# EAGLE design LPmini-Prototype_1.2 (EAGLE 6.4)
COMPANY: ADAFRUIT INDUSTRIES; DRAWN: KTOWN; REV: B
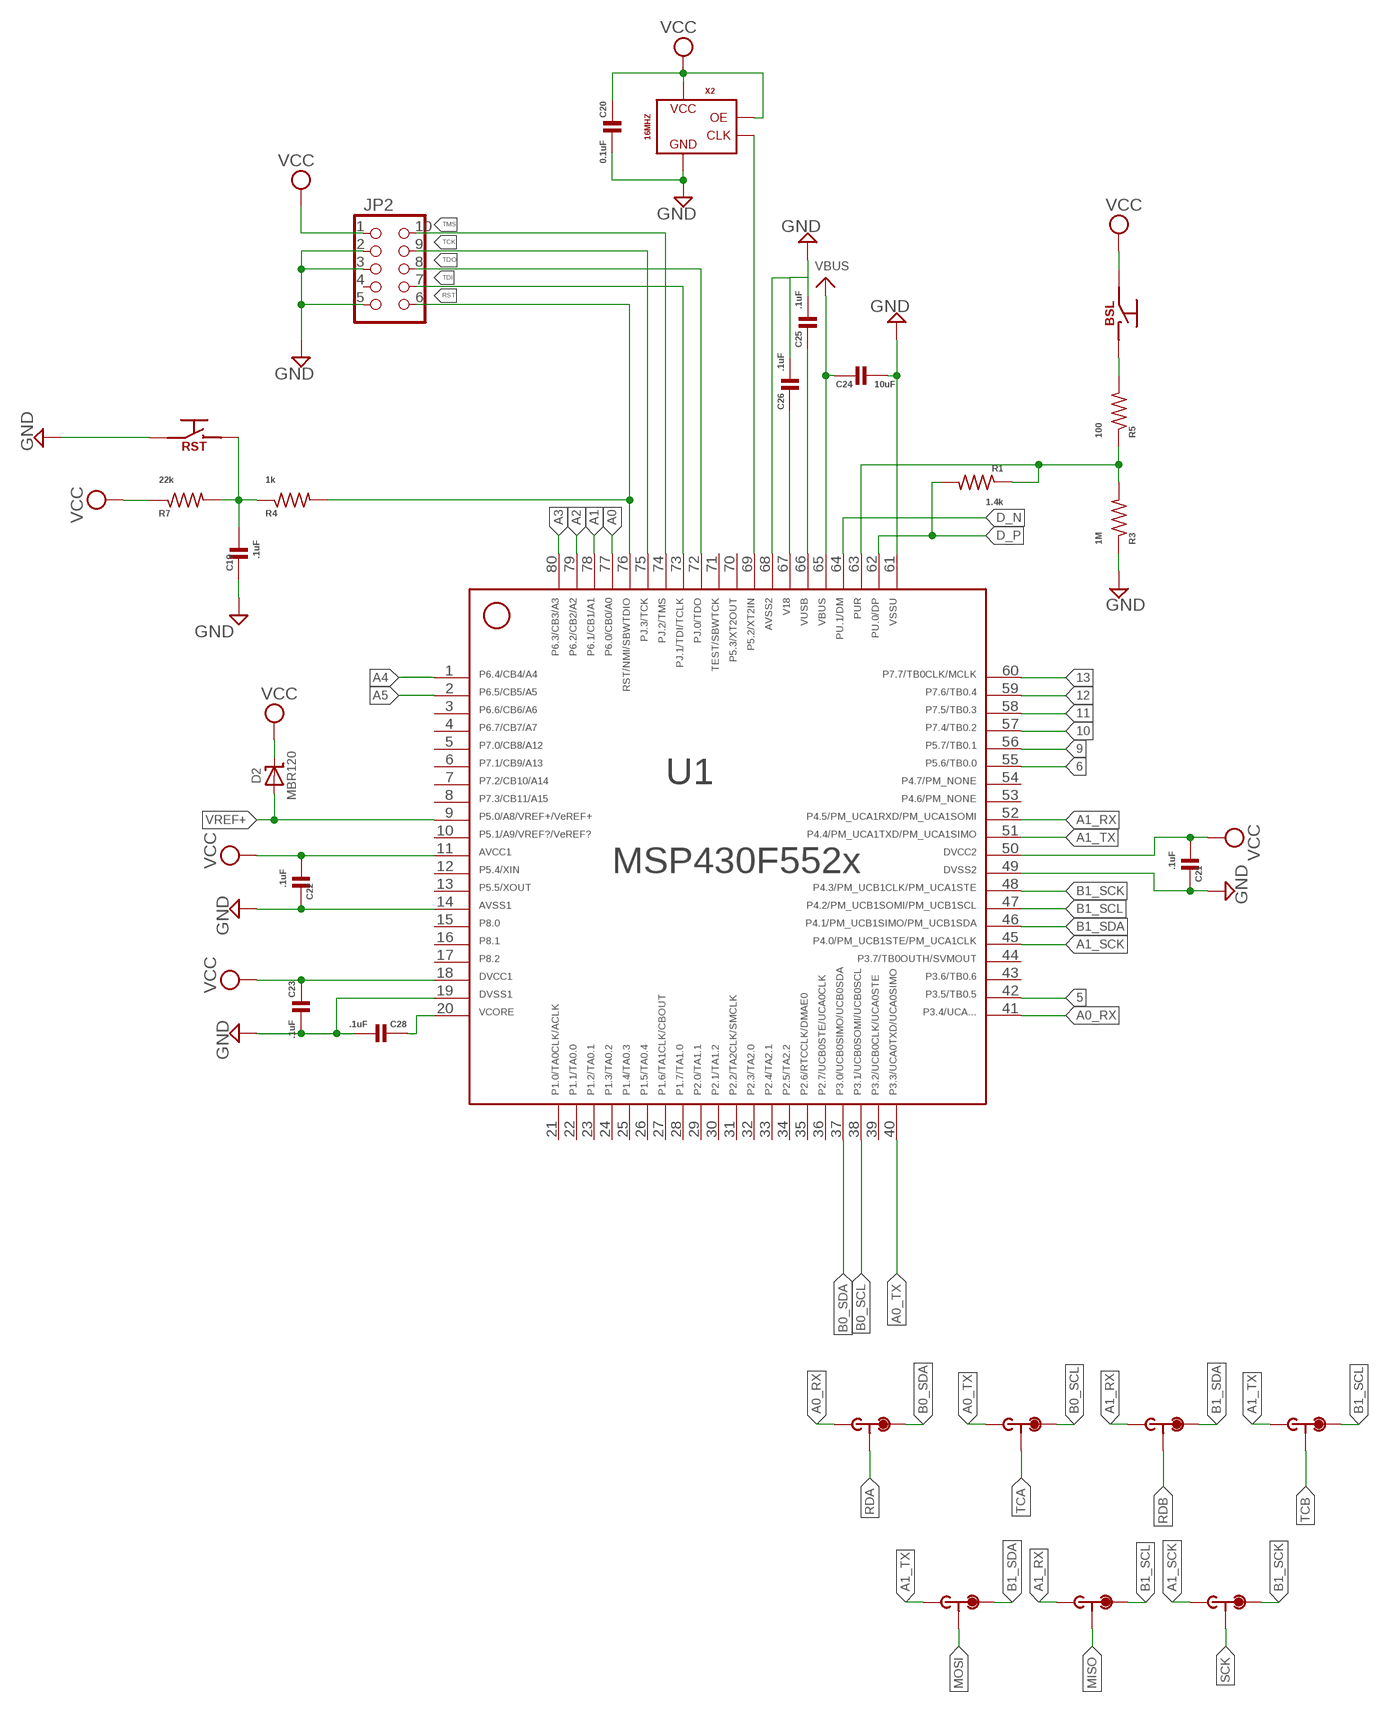
[diagram p0: schematic, sheet 1, part 1 of 2]
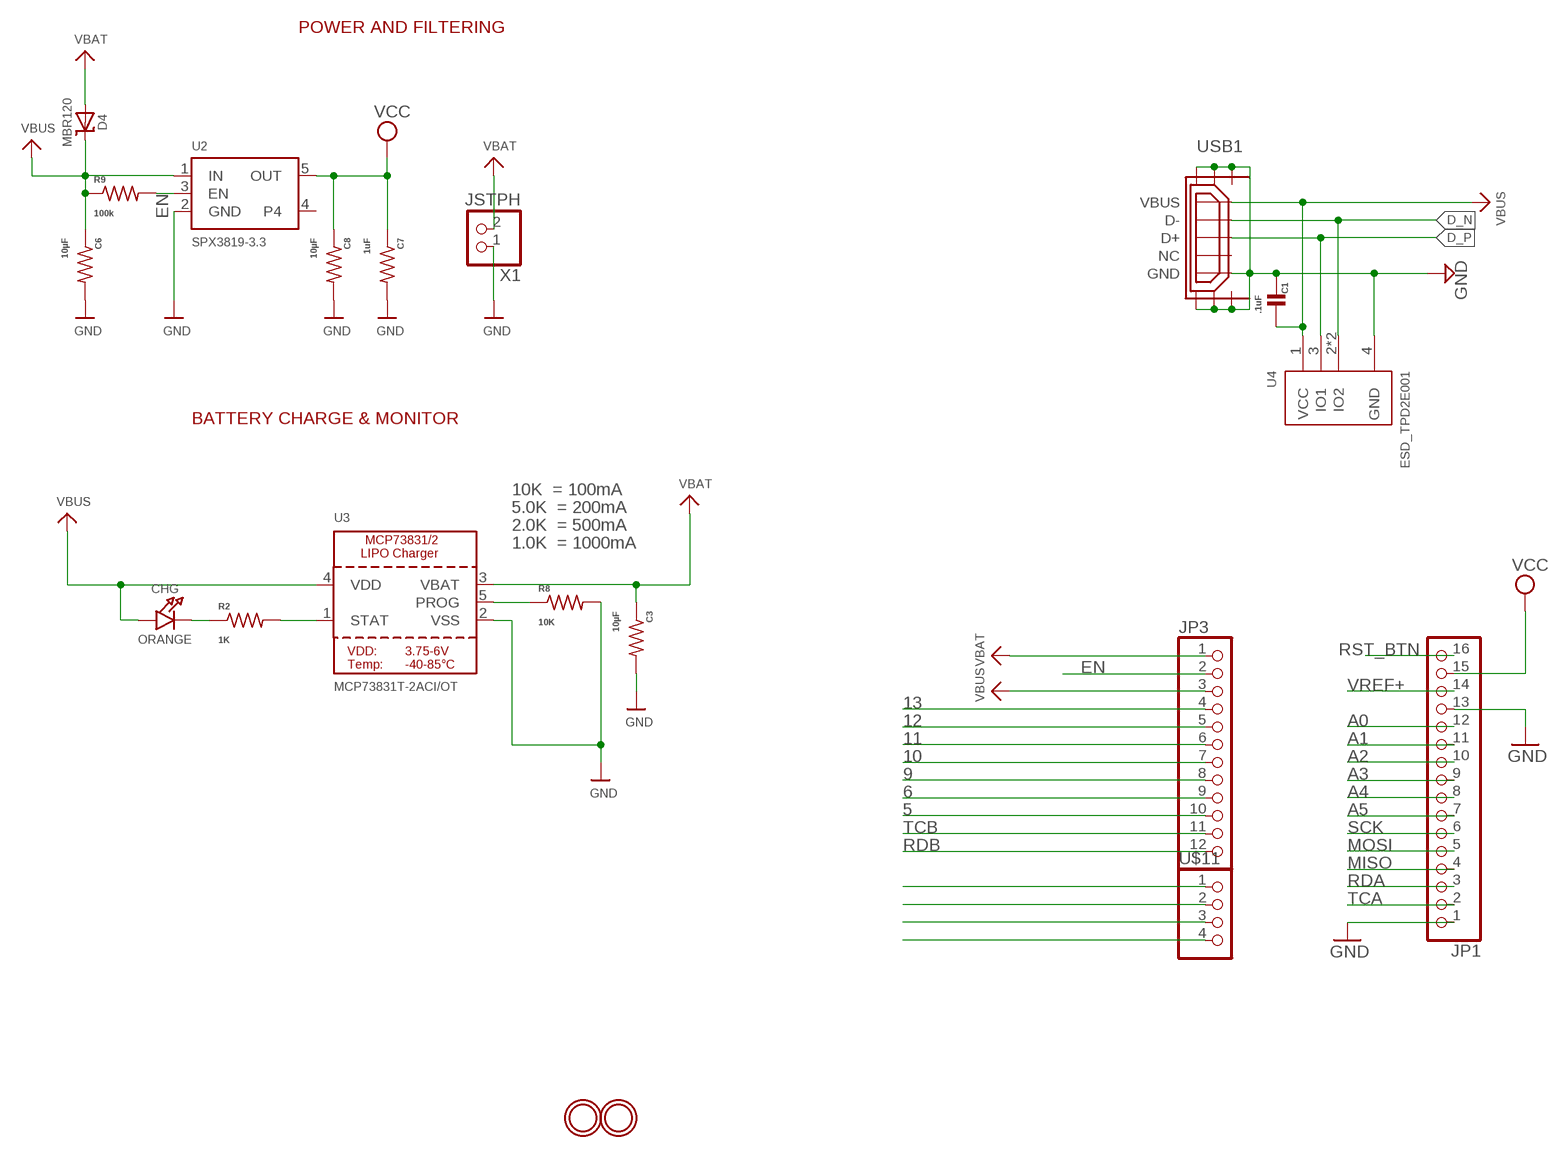
[diagram p1: schematic, sheet 1, part 2 of 2]

## Parts
BSL  PB_SMALL_SMD  [PB_KMR2]
C1  .1uF  C-EUC0402  [C0402]
C3  10µF  R-US_R0603  [R0603]
C6  10µF  R-US_R0603  [R0603]
C7  1uF  R-US_R0402  [R0402]
C8  10µF  R-US_R0603  [R0603]
C19  .1uF  C-EUC0402  [C0402]
C20  0.1uF  C-EUC0402  [C0402]
C21  .1uF  C-EUC0402  [C0402]
C22  .1uF  C-EUC0402  [C0402]
C23  .1uF  C-EUC0402  [C0402]
C24  10uF  C-EUC0603  [C0603]
C25  .1uF  C-EUC0402  [C0402]
C26  .1uF  C-EUC0402  [C0402]
C28  .1uF  C-EUC0402  [C0402]
CHG  ORANGE  LED0805_NOOUTLINE  [CHIPLED_0805_NOOUTLINE]
D2  MBR120  DIODE-SCHOTTKYSOD-123  [SOD-123]
D4  MBR120  DIODE-SCHOTTKYSOD-123  [SOD-123]
JP1  HEADER-1X16ROUND  [1X16_ROUND]
JP2  PINHD_2X05SMD  [2X05-SMALL_SMD]
JP3  HEADER-1X12  [1X12_ROUND]
R1  1.4k  R-US_R0402  [R0402]
R2  1K  R-US_R0402  [R0402]
R3  1M  R-US_R0402  [R0402]
R4  1k  R-US_R0402  [R0402]
R5  100  R-US_R0402  [R0402]
R7  22k  R-US_R0402  [R0402]
R8  10K  R-US_R0402  [R0402]
R9  100k  R-US_R0402  [R0402]
RST  PB_SMALL_SMD  [PB_KMR2]
U1  TI_MSP430_V16_INTERN_F552X---PN80  [TI_MSP430_V16_INTERN_PN80]
U2  SPX3819-3.3  VREG_SOT23-5  [SOT23-5]
U3  MCP73831T-2ACI/OT  MCP73831/2  [SOT23-5]
U4  ESD_TPD2E001  [PROJECT7264_TPD2E001-DRL]
U$2  3PT_SOLDER_JUMPER  [SOLDER_JUMPER_3]
U$4  3PT_SOLDER_JUMPER  [SOLDER_JUMPER_3]
U$5  3PT_SOLDER_JUMPER  [SOLDER_JUMPER_3]
U$6  3PT_SOLDER_JUMPER  [SOLDER_JUMPER_3]
U$8  3PT_SOLDER_JUMPER  [SOLDER_JUMPER_3]
U$9  3PT_SOLDER_JUMPER  [SOLDER_JUMPER_3]
U$10  3PT_SOLDER_JUMPER  [SOLDER_JUMPER_3]
U$11  PINHD_1X4  [1X04]
U$31  MOUNTINGHOLE2.5  [MOUNTINGHOLE_2.5_PLATED]
U$32  MOUNTINGHOLE2.5  [MOUNTINGHOLE_2.5_PLATED]
USB1  USB_CON-UPDATE_USB_MICRO_FLIPPED  [USB_CON-UPDATE_HIROSE-ZX62R-B-5P]
X1  JSTPH  CON_JST_PH_2PIN  [JSTPH2]
X2  16MHZ  OSCILLATOR_SMDHC335R  [OSCILLATOR_3.3X2.6]

## Nets
5: JP3.10 U1.42
6: JP3.9 U1.55
9: JP3.8 U1.56
10: JP3.7 U1.57
11: JP3.6 U1.58
12: JP3.5 U1.59
13: JP3.4 U1.60
A0: JP1.12 U1.77
A0_RX: U1.41 U$2.2(NO)
A0_TX: U1.40 U$8.2(NO)
A1: JP1.11 U1.78
A1_RX: U1.52 U$5.2(NO) U$9.2(NO)
A1_SCK: U1.45 U$6.2(NO)
A1_TX: U1.51 U$4.2(NO) U$10.2(NO)
A2: JP1.10 U1.79
A3: JP1.9 U1.80
A4: JP1.8 U1.1
A5: JP1.7 U1.2
B0_SCL: U1.38 U$8.1(NC)
B0_SDA: U1.37 U$2.1(NC)
B1_SCK: U1.48 U$6.1(NC)
B1_SCL: U1.47 U$5.1(NC) U$10.1(NC)
B1_SDA: U1.46 U$4.1(NC) U$9.1(NC)
D_N: U1.64 U4.2(IO2) U4.5(IO2) USB1.D-
D_P: R1.2 U1.62 U4.3(IO1) USB1.D+
EN: JP3.2 R9.2 U2.3(EN)
GND: C1.2 C3.2 C6.2 C7.2 C8.2 C19.2 C20.2 C21.2 C22.2 C23.2 C24.2 C25.2 C26.2 C28.2 JP1.1 JP1.13 JP2.2 JP2.3 JP2.5 R3.1 R8.2 RST.1A(A) RST.1B(A) U1.14 U1.19 U1.49 U1.61 U1.68 U2.2(GND) U3.2(VSS) U4.4(GND) USB1.GND USB1.SHIELD1 USB1.SHIELD2 USB1.SHIELD3 USB1.SHIELD4 USB1.SHIELD5 USB1.SHIELD6 X1.1 X2.2
MISO: JP1.4 U$5.C(IN)
MOSI: JP1.5 U$4.C(IN)
N$1: CHG.C R2.1
N$2: U$11.1
N$3: R2.2 U3.1(STAT)
N$4: R8.1 U3.5(PROG)
N$5: BSL.2A(B) BSL.2B(B) R5.2
N$6: R1.1 R3.2 R5.1 U1.63
N$7: U$11.2
N$8: U$11.3
N$9: U$11.4
N$23: C25.1 U1.66
N$24: C26.1 U1.67
N$25: C28.1 U1.20
N$40: U1.69 X2.3
RDA: JP1.3 U$2.C(IN)
RDB: JP3.12 U$9.C(IN)
RST: JP2.6 R4.2 U1.76
RST_BTN: C19.1 JP1.16 R4.1 R7.2 RST.2A(B) RST.2B(B)
SCK: JP1.6 U$6.C(IN)
TCA: JP1.2 U$8.C(IN)
TCB: JP3.11 U$10.C(IN)
TCK: JP2.9 U1.75
TDI: JP2.7 U1.73
TDO: JP2.8 U1.72
TMS: JP2.10 U1.74
VBAT: C3.1 D4.A JP3.1 U3.3(VBAT) X1.2
VBUS: C1.1 C6.1 C24.1 CHG.A D4.C JP3.3 R9.1 U1.65 U2.1(IN) U3.4(VDD) U4.1(VCC) USB1.VBUS
VCC: BSL.1A(A) BSL.1B(A) C7.1 C8.1 C20.1 C21.1 C22.1 C23.1 D2.C JP1.15 JP2.1 R7.1 U1.11 U1.18 U1.50 U2.5(OUT) X2.1 X2.4
VREF+: D2.A JP1.14 U1.9
Unconnected: JP2.4 U1.3 U1.4 U1.5 U1.6 U1.7 U1.8 U1.10 U1.12 U1.13 U1.15 U1.16 U1.17 U1.21 U1.22 U1.23 U1.24 U1.25 U1.26 U1.27 U1.28 U1.29 U1.30 U1.31 U1.32 U1.33 U1.34 U1.35 U1.36 U1.39 U1.43 U1.44 U1.53 U1.54 U1.70 U1.71 U2.4 USB1.NC

## Notes on the sheet
- POWER AND FILTERING
- BATTERY CHARGE & MONITOR
- 10K  = 100mA
- 5.0K  = 200mA
- 2.0K  = 500mA
- 1.0K  = 1000mA

## Library data of the parts
BSL RST = 0Joseph:PB_SMALL_SMD
C1 C19-C26 C28 = rcl:C-EU: CAPACITOR, European symbol
C3 C6-C8 R1-R5 R7-R9 = rcl:R-US_: RESISTOR, American symbol
CHG = microbuilder:LED: LED 0603 - 0603 Surface Mount Package 2mA: Green LED - Low Power (3.9mcd, 2ma, 1.7Vf) - Digikey: 475-2709-2-ND Orange LED - Low Power (9.8mcd, 2ma, 1.8Vf) - Digikey: 475-1194-2-ND Red LED - Low Power (5mcd, 2ma, 1.8Vf) - Digikey: 475-1195-2-ND Yellow LED - Low Power (7mcd, 2ma, 1.8Vf) - Digikey: 475-1196-2-ND 5mA: Blue LED - Low Power (17mcd, 5ma, 2.9Vf) - Digikey: LNJ937W8CRACT-ND 0805 - 0805 Surface Mount Package 2mA: Red LED (8.8mcd, 2mA, 1.8Vf, Clear) - Low Power [Digikey: 475-2510-1-ND] Green LED (5mcd, 2mA, 1.8Vf, Clear) - Low Power [Digikey: 475-2730-1-ND] Yellow LED (11.3mcd, 2mA, 1.8Vf, Clear) - Low Power [Digikey: 475-2555-1-ND] 20mA: Red LED (104mcd, 20mA, Diffused) - LS R976 [Digikey: 475-1278-6-ND] Red LED (12mcd, 20mA, 2.0Vf, Clear) - APT2012EC [Digikey: 754-1128-1-ND] Green LED (15mcd, 20mA, 2.2Vf, Clear) - APT2012GC [Digikey: 754-1131-1-ND] Orange LED (160mcd, 20mA, 2.1Vf, Clear) - APT2012SECK [Digikey: 754-1130-1-ND] 1206 - 1206 Surface Mount Package Green LED (26mcd, 20mA, Diffused) - LG N971 [Digikey: 475-1407-6-ND] Red LED (15mcd, 20mA, Diffused) - LH N974 [Digikey: 475-1416-6-ND] Cree - Cree High-Power Surface Mount LEDs XPEBWT-L1-0000-00D50 - White 111lm 350mA 2.9Vf 6200K 110° XTEAWT-00-0000-00000LEE3 - White 114lm 350mA 2.85Vf 5000K 115° Everlight - Everlight 45-21 Series Surface Mount LEDs 45-21/QK2C-B2832AC2CB2/2T - Warm White 2000mcd 20mA 3.25Vf 3050K 120° 45-21/LK2C-B38452C4CB2/2T - Nuetral White 2000mcd 20mA 3.25Vf 4150K 120° 45-21/LK2C-B50634C6CB2/2T - Cold White 2200mcd 20mA 3.25Vf 5650K 120° PLCC2 Reverse Mount LS T77K-J1L2-1-0-2-R18-Z - Red 11.25mcd 2mA 1.8Vf 630nm 120° LO T77K-L1M2-24-Z - Orange 19.6mcd 2mA 1.8Vf 606nm 120° LY T77K-K2M1-26-Z - Yellow 15.7mcd 2mA 1.8Vf 587nm 120°
D2 D4 = microbuilder:DIODE-SCHOTTKY
JP1 = microbuilder:HEADER-1X16: PIN HEADER
JP2 = 0Joseph:PINHD_2X05
JP3 = microbuilder:HEADER-1X12
U1 = 0Joseph:TI_MSP430_V16_INTERN_F552X---PN80: ***MSP430F552X***PN80 http://www.ti.com/lit/gpn/msp430f5529 Rev1.0 06/2010 For F552X where X is 1,5,7,9
U2 = microbuilder:VREG_SOT23-5: SOT23-5 Fixed Voltage Regulators Part Current Out V Out V In V Dropout θJA (°C/W) TJ (°C) Digikey Part No. ADP121 150mA 3.3V 3.4-5.5V 0.09V @ 150mA -- -- ADP121-AUJZ33R7CT-ND ADP121 150mA 3.0V 3.1-5.5V 0.09V @ 150mA -- -- ADP121-AUJZ30R7CT-ND ADP122 300mA 3.3V 3.4-5.5V 0.085V @ 300mA -- -- ADP122AUJZ-3.3-R7CT-ND ADP1712 300mA 3.3V 3.5-5.5V 0.17V @ 300mA -- -- ADP1712AUJZ-3.3-R7TR-ND AP7311 (Low Cost) 150mA 3.3V 3.5-6V 0.15V @ 150mA -- -- AP7311-33WG-7DICT-ND LD39015M18R 150mA 1.8V 1.9V-5.5V 0.08V @ 100mA -- -- 497-6977-1-ND LP2985A-33DBVR 150mA 3.3V 3.3-16V 0.28V @ 150mA 206 150 296-18479-1-ND MCP1824T-3302E/OT 300mA 3.3V 3.5V-6V 0.2V @ 300mA -- -- MCP1824T-3302E/OTCT-ND MIC5205-2.5YM5 TR 150mA 2.5V 2.7-16V 0.165V @ 150mA -- -- 576-1257-2-ND MIC5205-3.0YM5 TR 150mA 3.0V 3.2V-16V 0.165V @ 150mA -- -- 576-1258-2-ND MIC5205-3.3YM5 TR 150mA 3.3V 3.5V-16V 0.165V @ 150mA -- -- 576-1259-2-ND TPS780330220 150mA 3.3V+2.2V 3.6-5.5V 250mV Max -- -- 296-23332-1-ND TDA3663/N1,135 100mA 3.3V 3.5-45V 0.18V @ 50mA -- -- 568-5343-1-ND Max operating temp can be calculated using θJA, TJ (max junction temperature), and power in watts. Set the "Maximum Ambient Temperature" until it reaches TJ ("Max Junction Temperature"), which is the absolute limit for safe use of the regulator: Heat Sink Temperature Calculator <http://www.daycounter.com/Calculators/Heat-Sink-Temperature-Calculator.phtml> For example, With 12V source into a 3.3V LP2985 and a 30mA load, we are dissipating (12V-3.3V) * 0.03A = 0.261W. With a θJA of 206 °C/W, a TJ of 150°C, and 261mW we can safely use the chip without a heat sink up to 75°C (=147.1°C Junction Temperature).
U3 = microbuilder:MCP73831/2: MCP73831/2 LIPO Charger VDD: 3.75 - 6V Temp -40 - 85°C Programmable Charge Rate: 15-500mA NOTE: STAT is a tri-state logic output on the MCP73831 and an open-drain output on the MCP73832. SOT23-5 with 4.2V output and tri-state logic on STAT = MCP73831T-2ACI/OT
U4 = 0Joseph:ESD_TPD2E001: TPD2E001 ESD-protection diode array
U$2 U$4-U$6 U$8-U$10 = 0Joseph:3PT_SOLDER_JUMPER
U$11 = 0Joseph:PINHD_1X4
U$31 U$32 = microbuilder:MOUNTINGHOLE: Mounting Hole For #2 screws (0.086"/2.18mm width, 0.094"/2.4mm hole) use 2.5mm; BOM: EXCLUDE
USB1 = 0Joseph:USB_CON-UPDATE_USB_MICRO_FLIPPED
X1 = microbuilder:CON_JST_PH_2PIN: JST 2-Pin Right-Angle Connector PH-Series - 4UConnector: 17311 SH-Series - 4UConnector: 07278
X2 = 0Joseph:OSCILLATOR_SMD

## Board
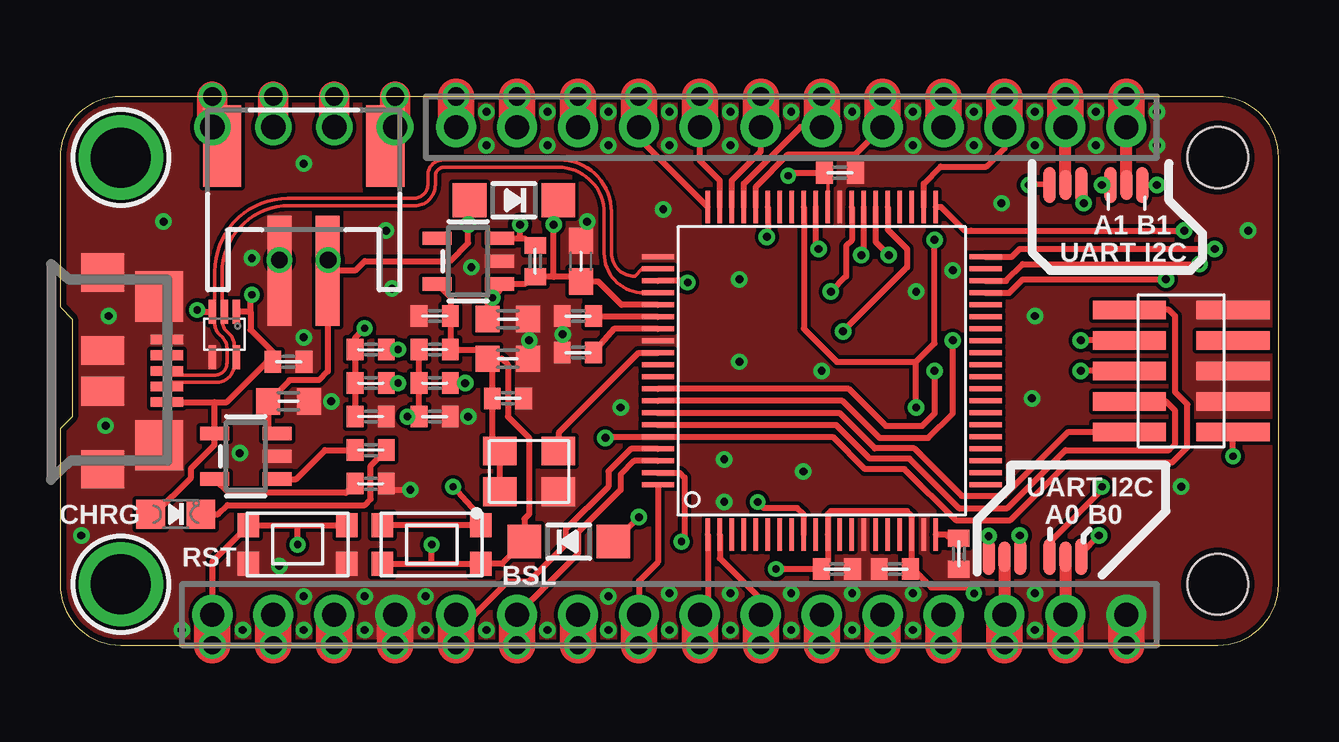
[diagram p2: board, top side]
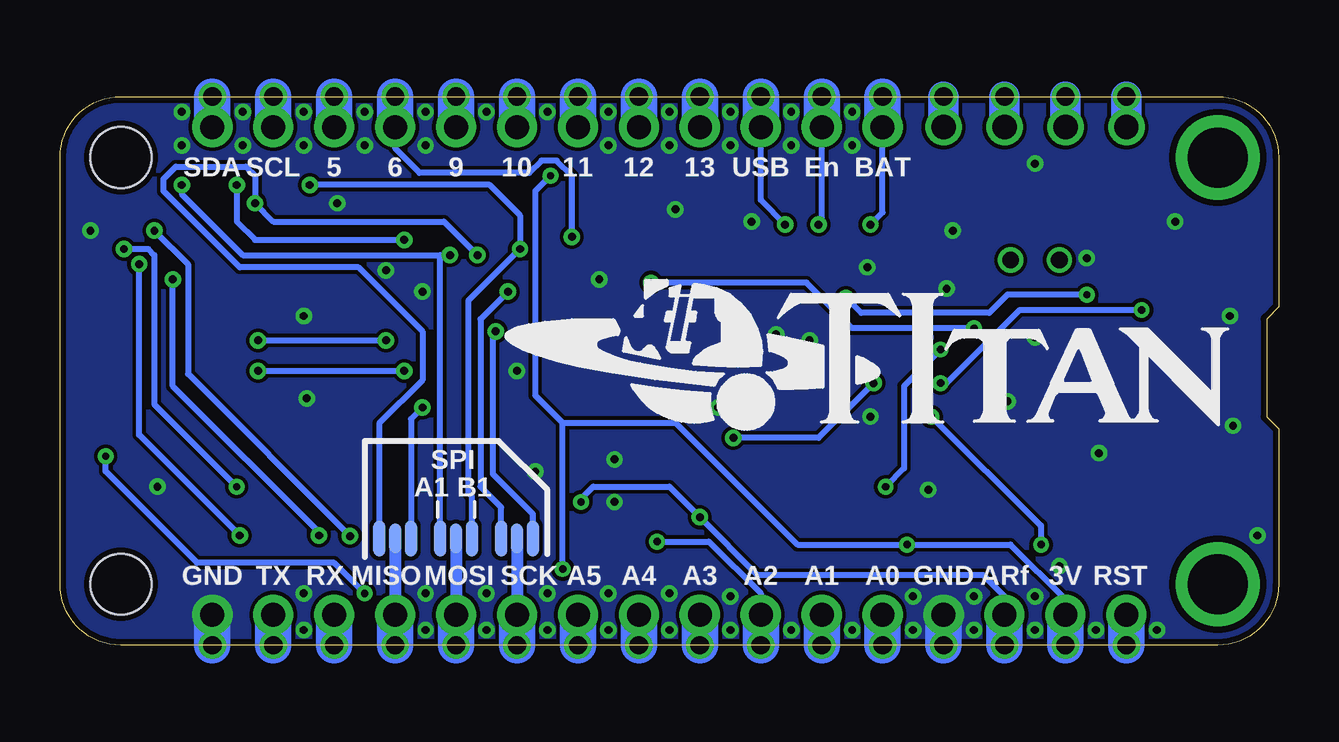
[diagram p3: board, bottom side, seen from below]

Size 50.8 x 22.86 mm. Coordinates in mm from the lower left corner, seen from the top.
Outline: 48.26,0 arc90 50.8,2.54 50.8,20.32 arc90 48.26,22.86 2.54,22.86 arc90 0,20.32 0,14.1 0.51,13.59 0.51,9.53 0,9.02 0,2.54 arc90 2.54,0 48.26,0
Copper layers (1*16): Top 0.0356mm / dielectric 1.5011mm / Bottom 0.0356mm
Design rules "Joseph *": minimum track width 6mil, minimum drill 12mil, track to track 6mil, track to pad 6mil, pad to pad 6mil, via to via 6mil, smd to smd 0mil, copper to edge 10mil, drill to drill 6mil, minimum pad ring 7mil, minimum via ring 7mil, stop-mask expansion 1mil, vias tented up to drill 50mil, thermal gap 6mil
Holes 2.54 mm at 48.26,20.32 48.26,2.54

### Footprints (pad centres in the part's own frame; a part is rotated, then mirrored left to right if it is on the bottom)
PB_KMR2 = smd 0.9 x 1: 1A -2.05,0.8; 1B 2.05,0.8; 2A -2.05,-0.8; 2B 2.05,-0.8
C0402 = smd 0.7 x 0.9: 1 -0.65,0; 2 0.65,0
R0603 = smd 1 x 1.1: 1 -0.85,0; 2 0.85,0
R0402 = smd 0.7 x 0.9: 1 -0.65,0; 2 0.65,0
C0603 = smd 1.1 x 1: 1 -0.85,0; 2 0.85,0
CHIPLED_0805_NOOUTLINE = smd 1.2 x 1.2: A 0,-1.05; C 0,1.05
SOD-123 = smd 1.4 x 1.4: A 1.85,0; C -1.85,0
1X16_ROUND = drill 1 pad 1.676: 1 -19.05,0; 2 -16.51,0; 3 -13.97,0; 4 -11.43,0; 5 -8.89,0; 6 -6.35,0; 7 -3.81,0; 8 -1.27,0; 9 1.27,0; 10 3.81,0; 11 6.35,0; 12 8.89,0; 13 11.43,0; 14 13.97,0; 15 16.51,0; 16 19.05,0
2X05-SMALL_SMD = smd 0.762 x 3.048: 1 -2.54,-2.159; 2 -1.27,-2.159; 3 0,-2.159; 4 1.27,-2.159; 5 2.54,-2.159; 6 2.54,2.159; 7 1.27,2.159; 8 0,2.159; 9 -1.27,2.159; 10 -2.54,2.159
1X12_ROUND = drill 1 pad 1.676: 1 -13.97,0; 2 -11.43,0; 3 -8.89,0; 4 -6.35,0; 5 -3.81,0; 6 -1.27,0; 7 1.27,0; 8 3.81,0; 9 6.35,0; 10 8.89,0; 11 11.43,0; 12 13.97,0
TI_MSP430_V16_INTERN_PN80 = smd 1.35 x 0.2: 1 -6.825,4.75; 2 -6.825,4.25; 3 -6.825,3.75; 4 -6.825,3.25; 5 -6.825,2.75; 6 -6.825,2.25; 7 -6.825,1.75; 8 -6.825,1.25; 9 -6.825,0.75; 10 -6.825,0.25; 11 -6.825,-0.25; 12 -6.825,-0.75; 13 -6.825,-1.25; 14 -6.825,-1.75; 15 -6.825,-2.25; 16 -6.825,-2.75; 17 -6.825,-3.25; 18 -6.825,-3.75; 19 -6.825,-4.25; 20 -6.825,-4.75; 41 6.825,-4.75; 42 6.825,-4.25; 43 6.825,-3.75; 44 6.825,-3.25; 45 6.825,-2.75; 46 6.825,-2.25; 47 6.825,-1.75; 48 6.825,-1.25; 49 6.825,-0.75; 50 6.825,-0.25; 51 6.825,0.25; 52 6.825,0.75; 53 6.825,1.25; 54 6.825,1.75; 55 6.825,2.25; 56 6.825,2.75; 57 6.825,3.25; 58 6.825,3.75; 59 6.825,4.25; 60 6.825,4.75 | smd 0.2 x 1.35: 21 -4.75,-6.825; 22 -4.25,-6.825; 23 -3.75,-6.825; 24 -3.25,-6.825; 25 -2.75,-6.825; 26 -2.25,-6.825; 27 -1.75,-6.825; 28 -1.25,-6.825; 29 -0.75,-6.825; 30 -0.25,-6.825; 31 0.25,-6.825; 32 0.75,-6.825; 33 1.25,-6.825; 34 1.75,-6.825; 35 2.25,-6.825; 36 2.75,-6.825; 37 3.25,-6.825; 38 3.75,-6.825; 39 4.25,-6.825; 40 4.75,-6.825; 61 4.75,6.825; 62 4.25,6.825; 63 3.75,6.825; 64 3.25,6.825; 65 2.75,6.825; 66 2.25,6.825; 67 1.75,6.825; 68 1.25,6.825; 69 0.75,6.825; 70 0.25,6.825; 71 -0.25,6.825; 72 -0.75,6.825; 73 -1.25,6.825; 74 -1.75,6.825; 75 -2.25,6.825; 76 -2.75,6.825; 77 -3.25,6.825; 78 -3.75,6.825; 79 -4.25,6.825; 80 -4.75,6.825
SOT23-5 = smd 0.55 x 1.2: 1 -0.95,-1.3; 2 0,-1.3; 3 0.95,-1.3; 4 0.95,1.3; 5 -0.95,1.3
PROJECT7264_TPD2E001-DRL = smd 0.3 x 1: 1 -0.5,-0.95; 2 0,-0.95; 3 0.5,-0.95; 4 0.5,0.95; 5 -0.5,0.95
SOLDER_JUMPER_3 = smd 0.508 x 1.524: 1 -0.66,0; 2 0.66,0 | smd 0.508 x 1.27: C 0,0
1X04 = drill 1.016: 1 -3.81,0; 2 -1.27,0; 3 1.27,0; 4 3.81,0
MOUNTINGHOLE_2.5_PLATED = drill 2.5 pad 3.2: P$1 0,0
USB_CON-UPDATE_HIROSE-ZX62R-B-5P = smd 1.35 x 0.4: D+ 2.675,0; D- 2.675,-0.65; GND 2.675,1.3; NC 2.675,0.65; VBUS 2.675,-1.3 | smd 1.778 x 1.6: SHIELD1 0,4.1; SHIELD2 0,-4.1 | smd 2 x 2.1: SHIELD3 2.35,3.1; SHIELD4 2.35,-3.1 | smd 1.778 x 1.2: SHIELD5 0,0.85; SHIELD6 0,-0.85
JSTPH2 = smd 1 x 4.6: 1 -1,-3.7; 2 1,-3.7 | smd 1.6 x 3.4: NC1 -3.4,1.5; NC2 3.4,1.5
OSCILLATOR_3.3X2.6 = smd 1.4 x 1.2: 1 -1.22,-0.85; 2 1.22,-0.85; 3 1.22,0.85; 4 -1.22,0.85

### Placement (x,y rotation side)
BSL  15.49,4.19 180 top
C1  9.53,11.81 0 top
C3  9.53,10.16 0 top
C6  18.67,13.59 0 top
C7  15.62,13.72 180 top
C8  18.67,11.94 0 top
C19  15.62,9.53 0 top
C20  18.67,10.29 0 top
C21  32.51,19.68 0 top
C22  32.38,3.17 0 top
C23  34.8,3.17 180 top
C24  21.72,16 90 top
C25  21.59,13.72 180 top
C26  21.59,12.19 180 top
C28  37.47,3.81 270 top
CHG  4.83,5.46 270 top
D2  21.21,4.32 0 top
D4  18.92,18.54 180 top
JP1  25.4,1.27 180 top
JP2  46.74,11.43 90 top
JP3  30.48,21.59 0 top
R1  12.95,10.92 0 top
R2  12.95,8.13 180 top
R3  12.95,9.53 180 top
R4  15.62,10.92 0 top
R5  12.95,12.32 0 top
R7  15.62,12.32 180 top
R8  12.95,6.73 0 top
R9  19.81,16 90 top
RST  9.91,4.19 180 top
U1  31.75,11.43 90 top
U2  17.02,16 90 top
U3  7.75,7.87 90 top
U4  6.86,12.95 180 top
U$2  39.37,3.68 180 top
U$4  34.29,4.45 0 bottom
U$5  36.83,4.45 0 bottom
U$6  31.75,4.45 0 bottom
U$7  [TITAN_LOGO]  15.88,11.56 0 bottom
U$8  41.91,3.68 180 top
U$9  44.45,19.18 180 top
U$10  41.91,19.18 180 top
U$11  10.16,21.59 0 top
U$31  2.54,20.32 270 top
U$32  2.54,2.54 270 top
USB1  1.78,11.43 0 top
X1  10.16,19.3 0 top
X2  19.56,7.24 0 top

### Tracks (layer width: path | path; a pad name or v marks a point on that pad's centre or on a via)
5  (via drill 0.76)
  Top 0.254: U1.42 36,19.24 36.7,19.94 38.61,19.94 39.37,20.7 JP3.10
  Top 1.524: JP3.10 v39.37,22.86
  Bottom 1.524: JP3.10 v39.37,22.86
6  (via drill 0.33, 0.76)
  Top 0.254: U1.55 29.5,17.05 v29.46,17.02
  Top 1.524: JP3.9 v36.83,22.86
  Bottom 0.254: v29.46,17.02 29.46,19.56 30.1,20.19 30.73,20.19 31.24,19.68 35.81,19.68 36.83,20.7 JP3.9
  Bottom 1.524: JP3.9 v36.83,22.86
9  (via drill 0.76)
  Top 0.254: U1.56 29,19.09 30.35,20.45 33.15,20.45 JP3.8
  Top 1.524: JP3.8 v34.29,22.86
  Bottom 1.524: JP3.8 v34.29,22.86
10  (via drill 0.76)
  Top 0.254: U1.57 28.5,19.23 30.86,21.59 JP3.7
  Top 1.524: JP3.7 v31.75,22.86
  Bottom 1.524: JP3.7 v31.75,22.86
11  (via drill 0.76)
  Top 0.254: U1.58 28,19.36 29.21,20.57 JP3.6
  Top 1.524: JP3.6 v29.21,22.86
  Bottom 1.524: JP3.6 v29.21,22.86
12  (via drill 0.76)
  Top 0.254: U1.59 27.5,19.36 26.67,20.19 JP3.5
  Top 1.524: JP3.5 v26.67,22.86
  Bottom 1.524: JP3.5 v26.67,22.86
13  (via drill 0.76)
  Top 0.254: U1.60 24.13,21.12 JP3.4
  Top 1.524: JP3.4 v24.13,22.86
  Bottom 1.524: JP3.4 v24.13,22.86
A0  (via drill 0.76)
  Top 0.254: U1.77 23.8,8.18 22.86,7.24 22.86,6.6 21.08,4.83 21.08,4.19 19.56,2.67 18.67,2.67 17.27,1.27 JP1.12
  Top 1.524: JP1.12 v16.51,0
  Bottom 1.524: JP1.12 v16.51,0
A0_RX  (via drill 0.33)
  Top 0.254: v38.71,4.55 U$2.2 | U1.41 36.74,18.25 37.72,17.27 37.97,17.27 v46.86,17.27
  Bottom 0.254: v38.71,4.55 45.47,11.3 45.47,15.88 v46.86,17.27
A0_TX  (via drill 0.3, 0.33)
  Top 0.254: U1.40 39.67,16.18 40.01,16.51 v48.13,16.51 | U$8.2 41.27,3.71 41.27,4.32 43.43,6.48 v43.43,6.6
  Bottom 0.254: v48.13,16.51 47.12,16.51 46.86,16.26 46.86,10.03 v43.43,6.6
A1  (via drill 0.76)
  Top 0.254: U1.78 23.94,7.68 23.37,7.11 23.37,6.48 21.59,4.7 21.59,3.81 JP1.11
  Top 1.524: JP1.11 v19.05,0
  Bottom 1.524: JP1.11 v19.05,0
A1_RX  (via drill 0.33)
  Top 0.254: 35.69,11.81 32.38,11.81 31,13.2 U1.52 | 35.69,11.81 36.45,12.57 v36.45,16.89 | v35.69,9.91 35.69,11.81 | U$9.2 v43.43,19.18
  Bottom 0.254: 36.2,4.47 U$5.2 36.17,9.42 v35.69,9.91 | v36.45,16.89 42.67,16.89 43.43,17.65 v43.43,19.18
A1_SCK  (via drill 0.33)
  Top 0.254: U1.45 34.5,17.32 35.31,16.51 35.31,15.75 v32.64,13.08
  Bottom 0.254: U$6.2 31.09,5.46 32.77,7.14 32.77,12.95 v32.64,13.08
A1_TX  (via drill 0.33)
  Top 0.254: v31.62,16.51 31.5,16.63 U1.51 | U$10.2 41.25,19.2 v40.39,19.18
  Bottom 0.254: U$4.2 33.63,6.2 33.78,6.35 33.78,14.35 v31.62,16.51 31.62,17.91 32.89,19.18 v40.39,19.18
A2  (via drill 0.3, 0.76)
  Top 0.254: U1.79 25.84,7.18 26.04,6.99 26.04,4.45 v25.91,4.32
  Top 1.524: JP1.10 v21.59,0
  Bottom 0.254: v25.91,4.32 23.75,4.32 21.59,2.16 JP1.10
  Bottom 1.524: JP1.10 v21.59,0
A3  (via drill 0.76)
  Top 0.254: U1.80 24.93,3.46 24.13,2.67 JP1.9
  Top 1.524: JP1.9 v24.13,0
  Bottom 1.524: JP1.9 v24.13,0
A4  (via drill 0.76)
  Top 0.254: U1.1 27,1.6 JP1.8
  Top 1.524: JP1.8 v26.67,0
  Bottom 1.524: JP1.8 v26.67,0
A5  (via drill 0.76)
  Top 0.254: U1.2 27.5,3.62 29.21,1.91 JP1.7
  Top 1.524: JP1.7 v29.21,0
  Bottom 1.524: JP1.7 v29.21,0
B0_SCL  (via drill 0.33)
  Top 0.254: U1.38 39.44,15.18 40.13,15.88 v47.5,15.88 | U$8.1 42.55,3.71 42.55,3.81 v43.31,4.57
  Bottom 0.254: v47.5,15.88 47.5,8.76 v43.31,4.57
B0_SDA  (via drill 0.33)
  Top 0.254: U1.37 39.57,14.68 40.13,15.24 v46.1,15.24 | U$2.1 40.01,3.71 v40.01,4.57
  Bottom 0.254: v46.1,15.24 46.1,10.79 40.01,4.7 v40.01,4.57
B1_SCK  (via drill 0.33)
  Top 0.254: U1.48 33,16.87 32.77,16.64 32.77,15.37 v32.13,14.73
  Bottom 0.254: U$6.1 32.41,5.74 33.27,6.6 33.27,13.59 v32.13,14.73
B1_SCL  (via drill 0.33)
  Top 0.254: v33.4,16.26 33.5,16.41 U1.47 | U$10.1 42.57,18.31 v42.67,18.41
  Bottom 0.254: v33.4,16.26 34.8,17.65 41.91,17.65 v42.67,18.41 42.67,19.56 43.05,19.94 45.97,19.94 46.48,19.43 46.48,18.92 43.31,15.75 38.35,15.75 35.69,13.08 35.69,11.05 37.49,9.25 U$5.1
B1_SDA  (via drill 0.33)
  Top 0.254: v34.54,16.26 34,16.8 U1.46 | U$9.1 v45.72,19.18
  Bottom 0.254: U$4.1 34.95,16.26 v34.54,16.26 43.18,16.26 45.72,18.8 v45.72,19.18
D_N
  Top 0.152: USB1.D- 4.62,10.95 6.5,10.95 arc90 7.26,11.71 7.26,12.12 | 6.76,13.93 6.76,13.53 arc45 6.94,13.09 7.08,12.95 arc-45 7.26,12.5 7.26,12.12 | 6.76,13.93 U4.2 | U4.5 7.28,12.13 7.26,12.12 | U1.64 24.33,14.68 arc-90 22.68,16.33 22.68,18.01 arc90 20.78,19.91 16,19.91 arc90 15.65,19.56 15.65,19.18 arc-90 14.78,18.31 9.55,18.31 arc90 6.76,15.52 6.76,13.93
D_P  (via drill 0.3)
  Top 0.152: USB1.D+ 4.63,11.25 6.45,11.25 arc90 6.96,11.76 6.96,12.37 arc45 6.77,12.82 6.64,12.96 arc-45 6.45,13.41 6.45,13.94 U4.3 6.45,14 6.45,15.57 arc-90 9.5,18.62 14.73,18.62 arc90 15.34,19.23 15.34,19.61 arc-90 15.95,20.22 20.83,20.22 arc-90 22.99,18.06 22.99,16.34 arc90 23.96,15.37 24.27,15.68 U1.62 | R1.2 v14.1,10.92
  Top 0.254: v5.71,13.97 5.78,13.9 U4.3
  Bottom 0.254: v5.71,13.97 10.79,13.97 13.84,10.92 v14.1,10.92
EN  (via drill 0.33, 0.76)
  Top 0.254: U2.3 19.16,16.95 | 19.16,16.95 19.37,16.95 R9.2 | 19.16,16.95 19.18,16.97 v19.18,17.53
  Top 1.524: JP3.2 v19.05,22.86
  Bottom 0.254: v19.18,17.53 19.05,17.65 JP3.2
  Bottom 1.524: JP3.2 v19.05,22.86
GND  (via drill 0.33, 0.76)
  Top 0.254: R8.2 13.86,6.48 v14.61,6.48
  Top 1.524: JP1.13 v13.97,0 | JP1.1 v44.45,0
  Bottom 1.524: JP1.13 v13.97,0 | JP1.1 v44.45,0
  other vias: 20.95,12.95 19.56,12.7 8,16.13 10.16,20.07 10.16,12.83 33.02,0.64 40.51,10.29 40.64,13.72 37.21,15.62 49.53,17.27 27.69,5.97 23.37,9.91 28.32,11.81 28.32,15.24 25.15,18.16 4.32,17.65 11.3,10.16 17.02,9.53 7.49,8 0.89,4.57 9.14,3.3 17.14,15.75 13.84,14.86 40.64,20.83 46.74,6.6 2.03,13.72 1.91,9.14 39.24,18.41 35.69,14.73 30.48,0.64 35.56,0.64 31.75,11.43 30.99,7.24 27.94,0.64 25.4,0.64 22.86,0.64 20.32,0.64 17.78,0.64 15.24,0.64 12.7,0.64 10.16,0.64 7.62,0.64 5.08,0.64 40.64,0.64 22.86,22.23 17.78,22.23 20.32,22.23 25.4,22.23 27.94,22.23 30.48,22.23 33.02,22.23 35.56,22.23 38.1,22.23 40.64,22.23 43.18,22.23 45.72,22.23 27.69,7.75 40.64,2.16 35.56,2.16 33.02,2.16 30.48,2.16 27.94,2.16 25.4,2.16 22.86,2.03 15.24,2.03 12.7,2.03 10.16,2.03 43.18,20.83 45.72,20.83 38.1,20.83 35.56,20.83 27.94,20.83 25.4,20.83 22.86,20.83 20.32,20.83 17.78,20.83 13.59,17.27 21.97,17.65
  pour Top (no thermals): 0,22.86 0,0 50.8,0 50.8,22.86
  pour Bottom (no thermals): 0,0 50.8,0 50.8,22.86 0,22.86
MISO  (via drill 0.76)
  Top 1.524: JP1.4 v36.83,0
  Bottom 0.508: U$5.C JP1.4
  Bottom 1.524: JP1.4 v36.83,0
MOSI  (via drill 0.76)
  Top 1.524: JP1.5 v34.29,0
  Bottom 0.508: U$4.C JP1.5
  Bottom 1.524: JP1.5 v34.29,0
N$1
  Top 0.254: CHG.C 6.6,5.46 6.99,5.84 12.7,5.84 12.95,6.1 12.95,7.48 R2.1
N$2  (via drill 0.76)
  Top 1.27: U$11.1 v6.35,22.86
  Bottom 1.27: U$11.1 v6.35,22.86
N$3
  Top 0.254: U3.1 9.85,6.92 11.05,8.13 R2.2
N$4
  Top 0.254: R8.1 11.92,6.35 7.02,6.35 U3.5
N$5  (via drill 0.3)
  Top 0.254: BSL.2B BSL.2A 17.54,5.32 v16.38,6.6 | R5.2 v14.1,12.32
  Bottom 0.254: v14.1,12.32 15.62,10.79 15.62,7.37 v16.38,6.6
N$6  (via drill 0.3)
  Top 0.254: R3.2 R1.1 R5.1 12.3,12.81 v12.7,13.21 | v26.16,15.11 26.09,15.18 U1.63
  Bottom 0.254: v12.7,13.21 17.78,13.21 19.68,15.11 v26.16,15.11
N$7  (via drill 0.76)
  Top 1.27: U$11.2 v8.89,22.86
  Bottom 1.27: U$11.2 v8.89,22.86
N$8  (via drill 0.76)
  Top 1.27: U$11.3 v11.43,22.86
  Bottom 1.27: U$11.3 v11.43,22.86
N$9  (via drill 0.76)
  Top 1.27: U$11.4 v13.97,22.86
  Bottom 1.27: U$11.4 v13.97,22.86
N$11  (via drill 0.7)
  other vias: 11.18,16.05
N$12  (via drill 0.7)
  other vias: 9.14,16.05
N$23
  Top 0.254: U1.66 22.33,13.68 C25.1
N$24
  Top 0.254: U1.67 23.09,13.18 22.24,12.21 C26.1
N$25
  Top 0.152: 36.53,4.57 U1.20
  Top 0.254: C28.1 37.46,4.11 36.96,4.61 U1.20
N$40
  Top 0.254: U1.69 24.12,12.18 20.79,8.85 X2.3
RDA  (via drill 0.76)
  Top 0.508: U$2.C JP1.3
  Top 1.524: JP1.3 v39.37,0
  Bottom 1.524: JP1.3 v39.37,0
RDB  (via drill 0.76)
  Top 0.508: U$9.C JP3.12
  Top 1.524: JP3.12 v44.45,22.86
  Bottom 1.524: JP3.12 v44.45,22.86
RST  (via drill 0.33)
  Top 0.254: R4.2 v16.89,10.92 | v22.73,8.64 22.78,8.68 U1.76 32.21,8.68 33.55,7.34 35.2,7.34 37.34,5.21 39.62,5.21 42.04,7.62 46.35,7.62 46.99,8.26 46.99,10.03 46.48,10.54 46.48,13.72 46.23,13.97 JP2.6
  Bottom 0.254: v22.73,8.64 19.18,8.64 v16.89,10.92
RST_BTN  (via drill 0.3, 0.76)
  Top 0.254: R7.2 R4.1 C19.1 v14.48,9.53 | 9.91,4.99 RST.2B 6.35,3.48 JP1.16 | 9.91,4.99 RST.2A | v9.91,4.19 9.91,4.99
  Top 1.524: JP1.16 v6.35,0
  Bottom 0.254: v14.48,9.53 9.94,4.99 | 9.94,4.99 9.91,4.99 | 9.94,4.99 9.91,4.95 v9.91,4.19
  Bottom 1.524: JP1.16 v6.35,0
SCK  (via drill 0.76)
  Top 1.524: JP1.6 v31.75,0
  Bottom 0.508: U$6.C JP1.6
  Bottom 1.524: JP1.6 v31.75,0
TCA  (via drill 0.76)
  Top 0.508: U$8.C JP1.2
  Top 1.524: JP1.2 v41.91,0
  Bottom 1.524: JP1.2 v41.91,0
TCB  (via drill 0.76)
  Top 0.508: U$10.C JP3.11
  Top 1.524: JP3.11 v41.91,22.86
  Bottom 1.524: JP3.11 v41.91,22.86
TCK
  Top 0.254: U1.75 32.35,9.18 33.76,7.77 35.41,7.77 37.47,5.71 39.5,5.71 41.91,8.13 46.23,8.13 46.48,8.38 46.48,9.78 46.1,10.16 JP2.9
TDI  (via drill 0.33)
  Top 0.254: U1.73 32.62,10.18 34.16,8.64 36.2,8.64 37.21,9.65 v37.21,12.7 | JP2.7 v42.55,12.7
  Bottom 0.254: v42.55,12.7 v37.21,12.7
TDO  (via drill 0.33)
  Top 0.254: U1.72 32.88,10.68 34.42,9.14 35.94,9.14 36.45,9.65 v36.45,11.43 | JP2.8 v42.55,11.43
  Bottom 0.254: v42.55,11.43 v36.45,11.43
TMS
  Top 0.254: U1.74 32.48,9.68 33.96,8.2 35.61,8.2 37.59,6.22 39.37,6.22 42.04,8.89 JP2.10
VBAT  (via drill 0.33, 0.76)
  Top 0.254: D4.A 17.02,18.6 v17.02,17.53 17.02,16.76 16.26,16 12.7,16 12.3,15.6 X1.2 11.16,11.41 10.79,11.05 9.56,11.05 C3.1 8.68,8.94 U3.3
  Top 1.524: JP3.1 v16.51,22.86
  Bottom 0.254: v17.02,17.53 16.51,18.03 JP3.1
  Bottom 1.524: JP3.1 v16.51,22.86
VBUS  (via drill 0.3, 0.33, 0.76)
  Top 0.254: USB1.VBUS 6.45,10.13 | 6.45,10.13 6.96,10.13 8.64,11.81 C1.1 8.88,12.21 7.94,13.14 7.94,13.9 | 7.94,13.9 U4.1 | C6.1 17.82,14.26 v18.03,14.48 18.32,14.76 U2.1 19.37,15.05 R9.1 20.57,15.35 | 7.94,13.9 7.94,14.54 v8,14.61 | 6.45,10.13 U3.4 6.45,8.35 5.46,7.37 5.46,6.99 3.94,5.46 CHG.A | 20.57,15.35 v20.57,17.53 20.57,18.41 D4.C | U1.65 23.41,14.18 22.44,15.15 C24.1 arc90 21.52,15.35 20.57,15.35
  Top 1.524: JP3.3 v21.59,22.86
  Bottom 0.254: v8,14.61 11.3,14.61 12.06,13.84 17.4,13.84 v18.03,14.48 | v20.57,17.53 21.59,18.54 JP3.3
  Bottom 1.524: JP3.3 v21.59,22.86
VCC  (via drill 0.3, 0.76)
  Top 0.152: U1.50 32,19.55 C21.1
  Top 0.254: U2.5 16.27,14.5 C7.1 R7.1 17.44,12.32 C8.1 | v29.84,3.17 C22.1 32,3.31 U1.11 32,5.46 32.13,5.59 35.31,5.59 35.5,5.39 U1.18 35.5,3.23 | v30.35,19.56 30.48,19.68 C21.1 | 35.56,3.06 C23.1 35.5,3.23 | BSL.1B 15.48,3.39 | 15.48,3.39 BSL.1A 18.43,3.39 D2.C 19.36,5.26 19.56,5.46 19.56,8.64 18.67,9.53 18.67,11.68 18.41,11.94 C8.1 | 15.48,3.39 15.48,4.18 v15.49,4.19 | X2.1 X2.4 18.02,8.41 C20.1 18.02,11.7 17.82,11.9 C8.1 | 35.5,3.23 36.31,2.41 37.85,2.41 v38.1,2.16 | v48.9,7.87 JP2.1
  Top 1.524: JP1.15 v8.89,0
  Bottom 0.254: 29.84,9.27 30.99,10.41 30.99,18.92 v30.35,19.56 | v29.84,3.17 29.84,9.27 | 29.84,9.27 25.15,9.27 20.07,4.19 v15.49,4.19 11.18,4.19 8.89,1.91 JP1.15 | v38.1,2.16 39.37,3.43 45.09,3.43 48.9,7.24 v48.9,7.87
  Bottom 1.524: JP1.15 v8.89,0
VREF+  (via drill 0.3, 0.33, 0.76)
  Top 0.254: U1.9 31,5.45 30.73,5.71 29.34,5.71 v29.08,5.97 | v24.13,5.33 D2.A
  Top 1.524: JP1.14 v11.43,0
  Bottom 0.254: v29.08,5.97 29.08,6.1 28.57,6.6 25.4,6.6 v24.13,5.33 21.72,2.92 12.32,2.92 11.43,2.03 JP1.14
  Bottom 1.524: JP1.14 v11.43,0

### Text on the board
tPlace: A1 B1 | UART I2C | UART I2C | CHRG | A0 B0 | RST | BSL
bPlace: BAT | En | USB | 13 | 12 | 11 | 10 | 9 | 6 | 5 | SCL | SDA | SPI | A1 B1 | RST | 3V | ARf | GND | A0 | A1 | A2 | A3 | A4 | A5 | SCK | MOSI | MISO | RX | TX | GND